# EAGLE schematic FH Charge ECU (EAGLE 8.1.0)
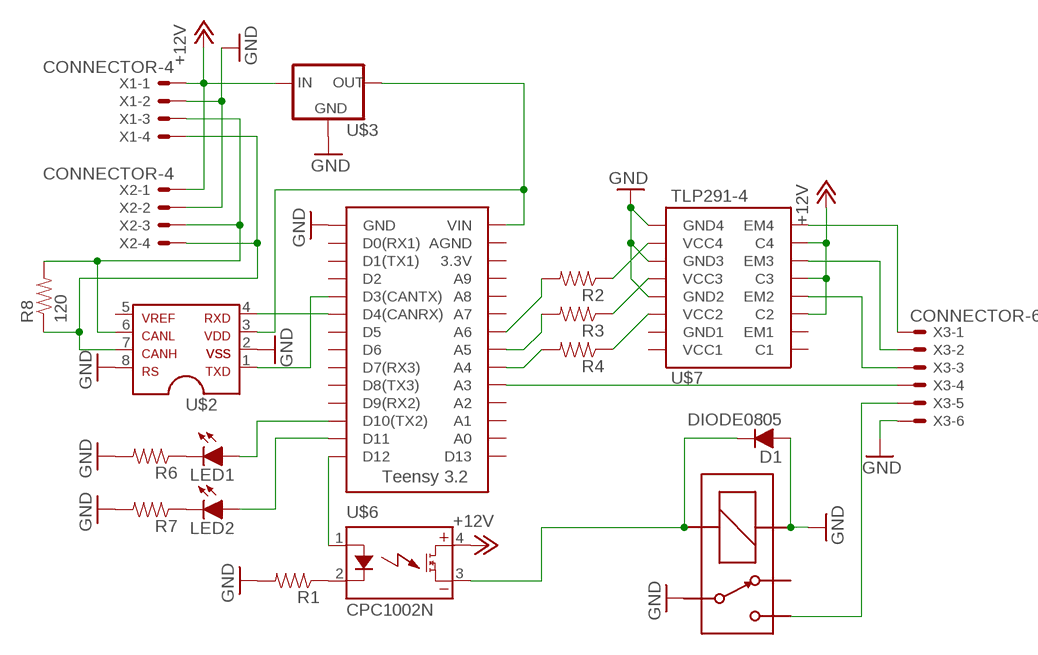
[diagram p0: schematic, sheet 1]

## Parts
D1  DIODE0805  [0805_D]
LED1  LED-0805  [LED-805]
LED2  LED-0805  [LED-805]
R1  RESISTOR0805-RES  [0805]
R2  RESISTOR0805-RES  [0805]
R3  RESISTOR0805-RES  [0805]
R4  RESISTOR0805-RES  [0805]
R6  RESISTOR0805-RES  [0805]
R7  RESISTOR0805-RES  [0805]
R8  120  RESISTOR0805-RES  [0805]
U$1  TEENSY_3.2_SIMPLE  [TEENSY_3.2_SIMPLE]
U$2  MCP2551  [SOIC-08]
U$3  5VREG_LM340-NLM340MPX-5.0/NOPB  [SOT223]
U$5  G5LE  [ZF112]
U$6  CPC1002N  [SOP04]
U$7  TLP291-4  [SOIC-16]
X1  CONNECTOR-4  [MINIFIT_5566-4]
X2  CONNECTOR-4  [MINIFIT_5566-4]
X3  CONNECTOR-6  [MINIFIT_5566-6]

## Nets
+12V: U$3.1(IN) U$6.4(DC+) U$7.10(C4) U$7.12(C3) U$7.14(C2) X1.1 X2.1
GND: D1.A R1.2 R6.2 R7.2 U$1.GND U$2.2 U$2.8 U$3.2(GND) U$3.4(GND) U$5.1(COIL+) U$5.P U$7.4(GND2) U$7.6(GND3) U$7.8(GND4) X1.2 X2.2 X3.6
N$1: U$1.A3 X3.4
N$2: U$1.VIN U$2.3 U$3.3(OUT)
N$3: R8.2 U$2.6 X1.3 X2.3
N$4: R8.1 U$2.7 X1.4 X2.4
N$5: D1.C U$5.2(COIL-) U$6.3(DC-)
N$6: U$1.D3(CANTX) U$2.1
N$7: U$1.D4(CANRX) U$2.4
N$8: U$1.D12 U$6.1(CONTROL+)
N$9: R1.1 U$6.2(CONTROL-)
N$10: U$7.13(EM2) X3.3
N$11: U$5.S X3.5
N$12: U$7.11(EM3) X3.2
N$13: U$7.9(EM4) X3.1
N$15: R4.2 U$1.A4
N$16: R3.2 U$1.A5
N$17: R2.2 U$1.A6
N$18: R3.1 U$7.5(VCC3)
N$19: R4.1 U$7.3(VCC2)
N$21: R2.1 U$7.7(VCC4)
N$22: LED1.C R6.1
N$23: LED2.C R7.1
N$24: LED1.A U$1.D10(TX2)
N$25: LED2.A U$1.D11
Unconnected: U$1.3.3V U$1.A0 U$1.A1 U$1.A2 U$1.A7 U$1.A8 U$1.A9 U$1.AGND U$1.D0(RX1) U$1.D1(TX1) U$1.D2 U$1.D5 U$1.D6 U$1.D7(RX3) U$1.D8(TX3) U$1.D9(RX2) U$1.D13 U$2.5 U$5.O U$7.1(VCC1) U$7.2(GND1) U$7.15(EM1) U$7.16(C1)

## Library data of the parts
D1 = HyTechDevices:DIODE: DIODE general purpose rectifier
LED1 LED2 = HyTechDevices:LED: Light Emitting Diode (LED) Source: Dangerous Prototypes Eagle Library <https://github.com/DangerousPrototypes/Eagle_Part_Library>
R1-R4 R6-R8 = HyTechDevices:RESISTOR: Resistor Basic schematic elements and footprints for 0603, 1206, and PTH resistors.
U$1 = HyTechDevices:TEENSY_3.2_SIMPLE: Simple version of the Teensy 3.2 board that only uses the 2 main rows of pins, not the inner pins or the pins opposite the usb port.
U$2 = HyTechDevices:MCP2551: MCP2551 High-Speed CAN Transceiver Product Webpage <https://www.microchip.com/wwwproducts/en/MCP2551> Datasheet <http://ww1.microchip.com/downloads/en/DeviceDoc/21667f.pdf> This device is outdated It is replaced by MCP2561. Comparison Page <https://www.microchip.com/wwwproducts/ProductCompare/MCP2551/MCP2561> Product Webpage <https://www.microchip.com/wwwproducts/en/MCP2561> Datasheet <http://ww1.microchip.com/downloads/en/DeviceDoc/20005167C.pdf>
U$3 = HyTechDevices:5VREG_LM340-N: Voltage Regulator 5v linear voltage regulator Datasheet <http://www.mouser.com/ProductDetail/Texas-Instruments/LM340MPX-50-NOPB/?qs=X1J7HmVL2ZGZwtTFRQ9ItA%3D%3D> MAX current out: 1.5A MAX voltage in: 35V
U$5 = HyTechDevices:G5LE: Omron G5LE SPST Relay 5 VDC, 12VDC, 24VDC models Coil voltage: 75% - 170% of nominal voltage Datasheet <https://www.omron.com/ecb/products/pdf/en-g5le.pdf>
U$6 = HyTechDevices:CPC1002N: IXYS Solid State Relay .7A
U$7 = HyTechDevices:TLP291-4: Toshiba Quad Channel Optocoupler TLP291-4
X1 X2 = HyTechDevices:CONNECTOR-4: Mini-Fit Junior connector 4 pole Source: http://www.molex.com; OC_FARNELL: unknown; OC_NEWARK: unknown
X3 = HyTechDevices:CONNECTOR-6: Mini-Fit Junior connector 6 pole Source: http://www.molex.com; MPN: 95566-61002; OC_FARNELL: unknown; OC_NEWARK: 22K8620